# Altium schematic sheet Counter Switch.SchDoc
size A4; SheetNumber: 2; SheetTotal: 2
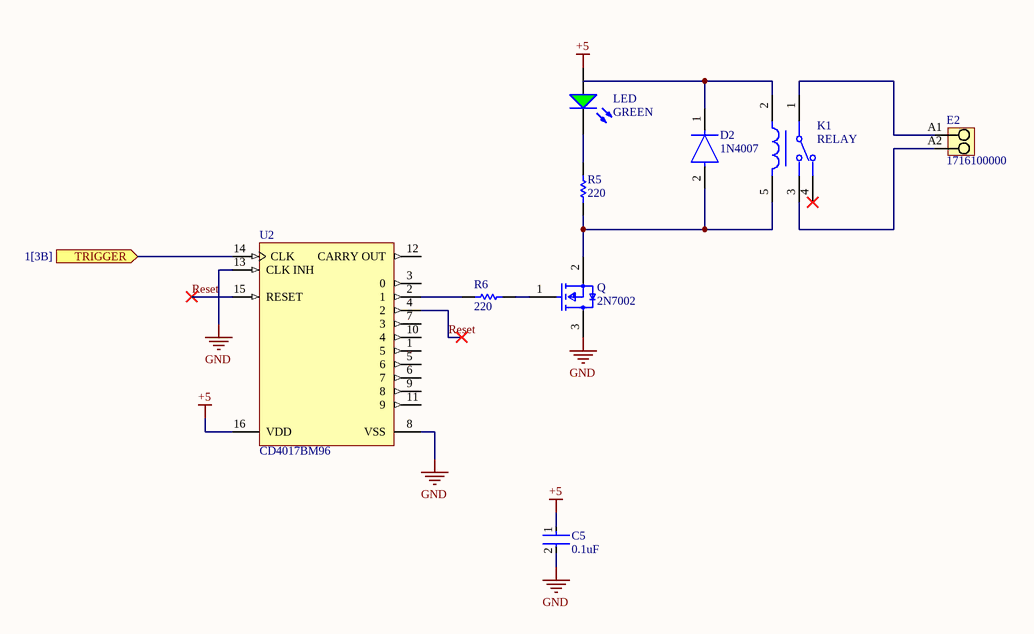
[diagram p0: Counter Switch.SchDoc]

## Parts
C5  0.1uF  [FP-GRM21B-0_1-MFG]
D2  1N4007  [FP-1N4007-MFG]
E2  1716100000  [LM_5_08_180_02]
K1  RELAY  [FP-G5LE-1-E-36-DC5-MFG]
LED  GREEN  [KING-WP7113SGD_V]
Q  2N7002  [FP-PG-SOT23-3-IPC_B]
R5  220  [RESC3216X60X45ML10T20]
R6  220  [RESC3216X60X45ML10T20]
U2  CD4017BM96  [D0016A_N]

## Ports
TRIGGER (in, see 1[3B])

## Nets
+5: C5.1 LED.1(A) U2.16(VDD)
GND: C5.2 Q.3(drain) U2.8(VSS) U2.13(CLK_INH)
Reset: U2.4(2) U2.15(RESET)
TRIGGER: U2.14(CLK) ; port TRIGGER
NetD2_1: D2.1(C) K1.2
NetD2_2: D2.2(A) K1.5 Q.2(source) R5.1
NetE2_A1: E2.A1 K1.1
NetE2_A2: E2.A2 K1.3
NetLED_2: LED.2(K) R5.2
NetQ_1: Q.1(gate) R6.2
NetR6_1: R6.1 U2.2(1)

Not connected (* = marked no-connect by the designer): K1 4*; U2 1(5) 3(0) 5(6) 6(7) 7(3) 9(8) 10(4) 11(9) 12(CARRY_OUT)

## Library data of the parts
C5 = CAP 0.1uF 10V 0805: Chip Multilayer Ceramic Capacitors for General Purpose, 0805, 0.10uF, U2J, -750ppm/°C, 5%, 10V; Capacitance: 100nF; Dielectric: U2J; Voltage Rating (DC): 10V; Thickness: 1.25mm; Width: 1.25mm; Length: 2mm; Case/Package: 0805; Tolerance: 5%
D2 = D2 Diode 1N4007: Rectifier diode 1000 V 1 A DO-41, ,; Manufacturer: Diotec; Max Surge Forward Current: 27A; Forward Current: 1A; Max Junction Temp: +175°C; Reverse Voltage: 1000V; Value: 15pF; Peak Reverse Current: 5uA; Category: Diode; Temperature Range Low: -50°C; Automotive: No; Temperature: -50°C to +175°C; Lead Free: Yes; ComponentLink2Description: Datasheet; Max Repetitive Reverse Voltage: 1000V; ComponentLink2URL: https://datasheet.octopart.com/1N4007-Diotec-datasheet-62346875.pdf; Manufacturer Part Number: 1N4007; Device Class L3: Rectifier Diodes; Height: 2.8mm; Octopart: https://octopart.com/1n4007-diotec-4040411; Package: 1N4007; Temperature Range High: +175°C; Device Class L1: Discrete Semiconductors; Device Class L2: Diodes; RoHS: TRUE; Capacitance: 15pF; Ipc Land Pattern Name: DIOAD888W100L520D280
E2 = Term Block 2Pos 14AWG: OMNIMATE Signal - series LM; Manufacturer: Weidmueller; Pitch_inch: 0,2 inch; Solid_max_H05_07_V_U: 2,5 mm²; Rated_voltage_for_surge_voltage_class_pollution_degree_II_2: 630 V; Rated_voltage_use_group_B_UL_1059: 300 V; Pitch_mm: 5,08 mm; Solder_pin_length_mm: 3,5 mm; Wire_cross_section_AWG_min_UL_1059: AWG 24; Wire_cross_section_AWG_max_UL_1059: AWG 14; No_of_poles: 2; Contact_surface: tinned; Short_text_for_material: LM 5.08/02/180 3.5SN OR BX; UL_94_flammability_rating: V-0; Rated_current_use_group_B_UL_1059: 15 A; Mounting_onto_the_PCB: Solder connection; Solid_min_H05_07_V_U: 0,2 mm²; Contact_material: Cu-Leg; Insulating_material: Wemid (PA); Side_termination_characteristic: closed side; PartNumber: 1716100000; ComponentLink2URL: http://catalog.weidmueller.com/catalog/Start.do?localeId=en&ObjectID=1716100000; ComponentLink1URL: http://www.weidmueller.com/; ComponentLink1Description: Manufacturer URL; Qty: 500 PCS; Colour: Orange; Packaging: Box; ComponentLink2Description: URL Link1; PackageReference: LM_5_08_180_02; Revision: V1
K1 = RELAY SPDT 5V: RELAY GEN PURPOSE SPDT 16A 5V; Coil Type: Non-Latching; Relay Type: General Purpose; Power Consumption: 400mW; Coil Resistance: 70R; Release Time: 5ms; Coil Current: 72mA; Coil Power: 360mW; Operate Time: 10ms; Coil Voltage (DC): 5V; Max Operating Temperature: 85°C; Contact Material: Tin; Package Quantity: 100; Throw Configuration: SPDT; Termination: PC Pin; Series: G5LE-E; Packaging: Tray; Min Operating Temperature: -40°C; Mount: Through Hole; Contact Current Rating: 16A
LED = LED Green 5mm: LED Green, 62.5 mW, 25 mA, -40 to 85 degC, 2-Pin THD, RoHS, Bulk; Manufacturer: Kingbright; Viewing Angle: 30degrees; Lens Style: Tinted; Test Current: 20mA; Forward Voltage: 2.2V; Wavelength: 568nm; Luminous Intensity: 40mcd; Package Reference: WP7113SGD; Colour: Green; Lead Free: LeadFree; Packaging: Bulk; RoHSCompliant: true; Package Quantity: 1000; Illumination Colour: Green; Case/Package: Radial; Datasheet URL: http://www.kingbrightusa.com/images/catalog/SPEC/WP7113SGD.pdf; Dominant Wavelength: 568nm; Datasheet Version: Rev. 6B, 01/2015; Package Description: 2-Pin Through Hole Device, Dia 5.9 mm, Body Length 8.6 mm; Height: 8.6mm
Q = MOSFET 2N7002 SMT: MOSFET N-CH 60V 0.3A SOT23; Rise Time: 3.3ns; Input Capacitance: 20pF; Rds On Max: 3R; Gate to Source Voltage (Vgs): 20V; Continuous Drain Current (ID): 300mA; Max Power Dissipation: 500mW; Packaging: Tape and Reel; Mount: Surface Mount; Case/Package: SOT-23; Drain to Source Voltage (Vdss): 60V; Min Operating Temperature: -55°C; Halogen Free: Halogen Free; Max Dual Supply Voltage: 60V; Number of Pins: 3; Lead Free: Lead Free; Max Operating Temperature: 150°C
R5 R6 = Res 220 Ohm 1/4W SMT: Manufacturer: Vishay Dale; Part Number: CRCW1206220RFKEA
U2 = IC CD4017: CMOS Decade Counter with 10 Decoded Outputs, D0016A, LARGE T&R; Manufacturer: Texas Instruments; Technology Family: CD4000; Schmitt Trigger: No; VCC(Max)(V): 18; Inputs: 1; tpd @ Nom Voltage(Max)(ns): 270; Rating: Military; Bits(#): 10; Output Drive (IOL/IOH)(Max)(mA): 1.5/-1.5; ICC @ Nom Voltage(Max)(mA): 0.03; F @ Nom Voltage(Max)(Mhz): 8; VCC(Min)(V): 3; Output Type: CMOS; Operating Temperature Range(C): -55 to 125; Generic Part Number: CD4017B; Type: Decade; DatasheetVersion: SCHS027C; Input Type: CMOS; Function: Counter; PackageReference: D0016A; Code_JEDEC: MS-012 variation AC; Voltage(Nom)(V): 10